# EAGLE design Due Shield v1.0 (EAGLE 7.2.0)
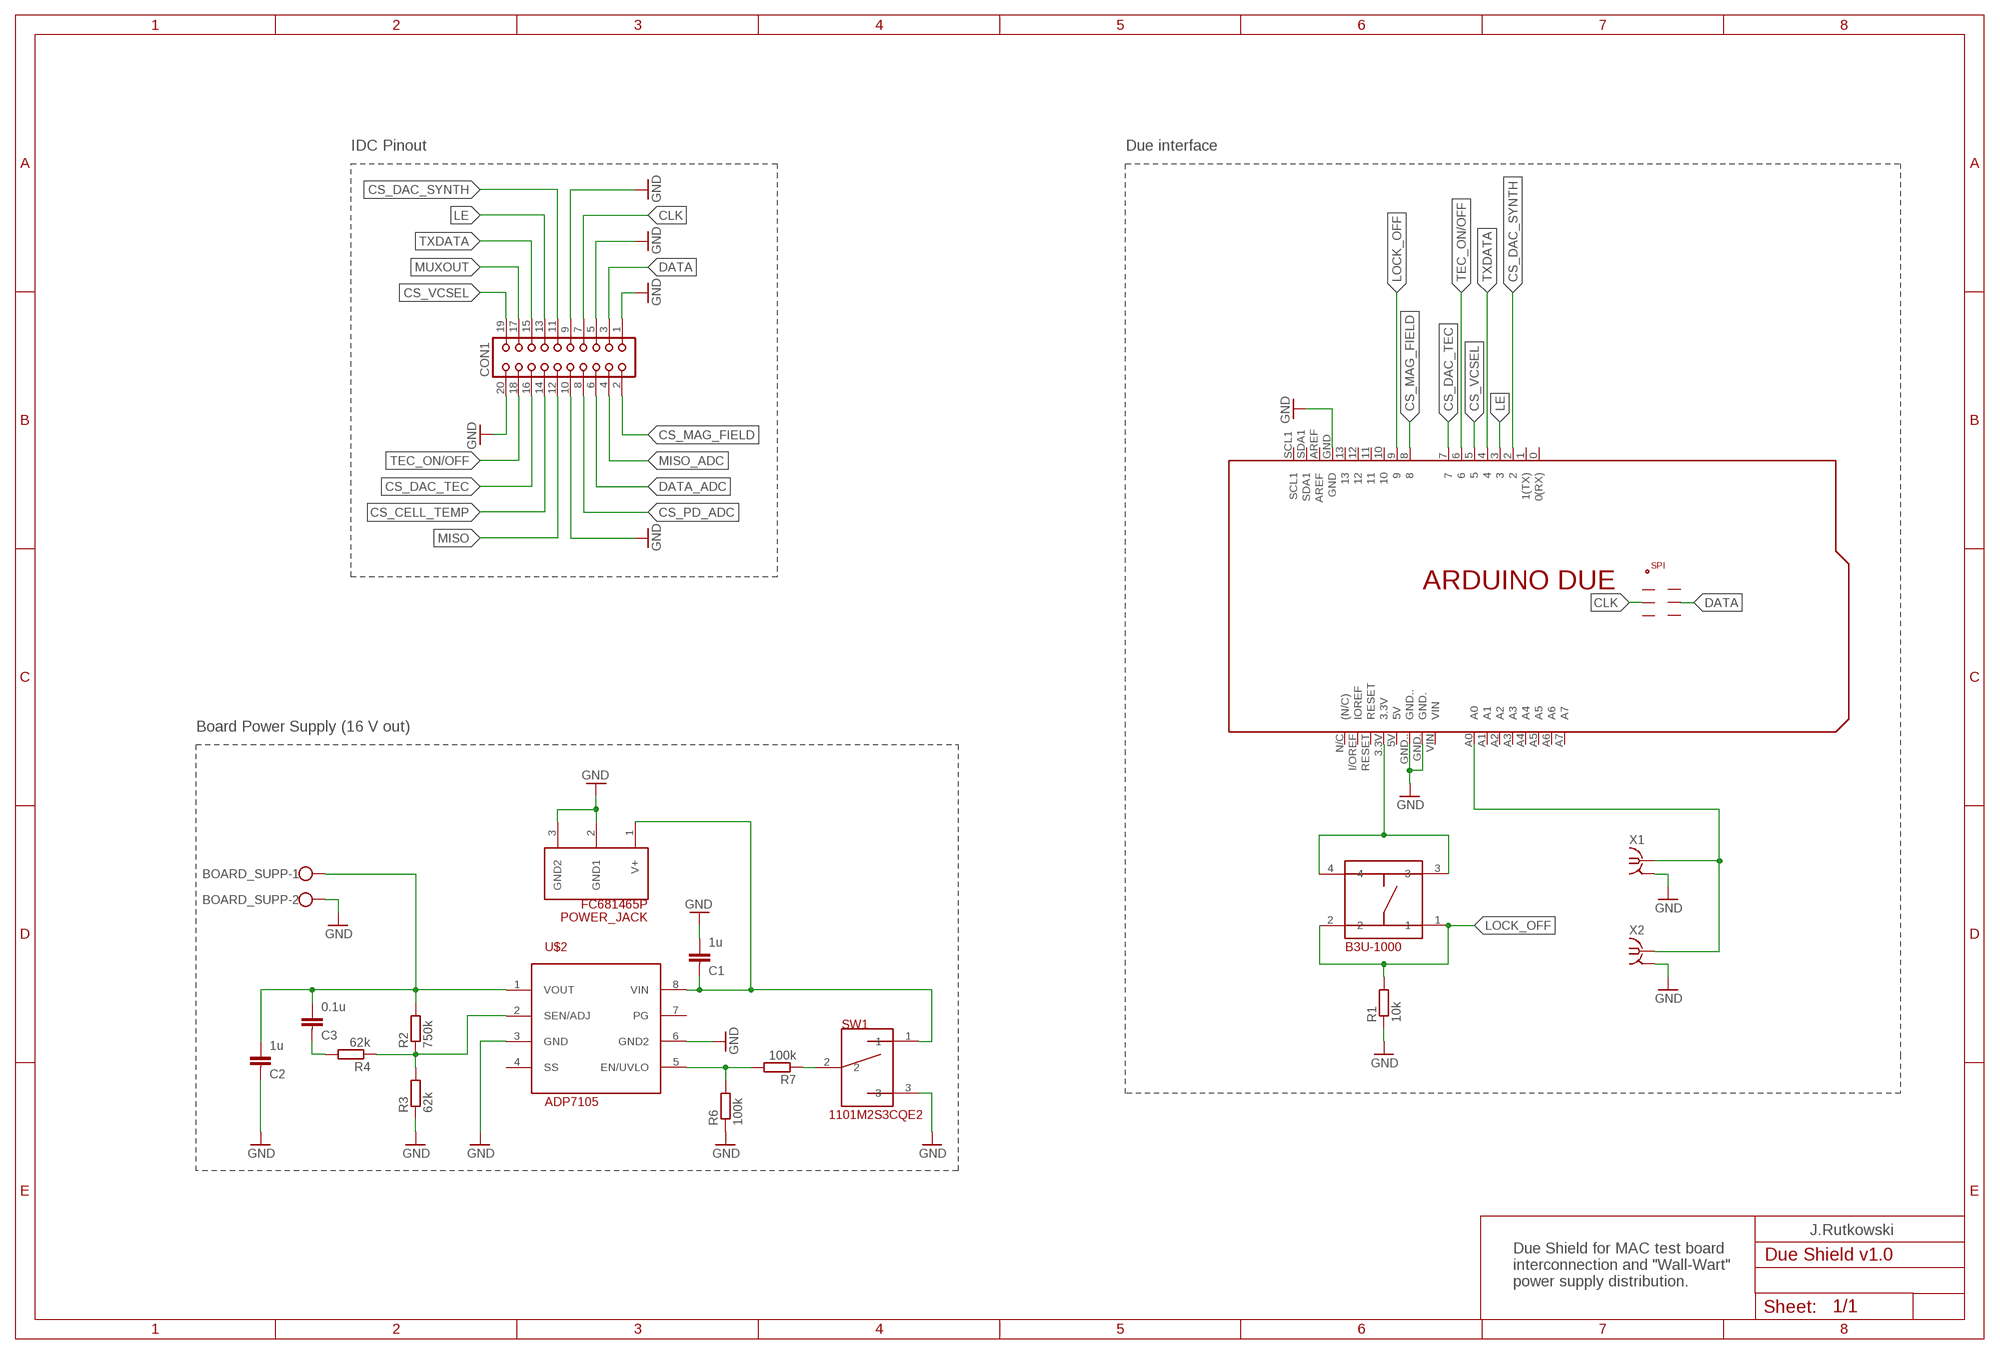
[diagram p0: schematic, sheet 1]

## Parts
BOARD_SUPP  W237-102  [W237-102]
C1  1u  C-EUC0805K  [C0805K]
C2  1u  C-EUC0805K  [C0805K]
C3  0.1u  C-EUC0805K  [C0805K]
CON1  CON20  [CON20]
PCB1  ARDUINO_DUE  [ARDUINO_DUE]
POWER_JACK  FC681465P  [FC681465P]
R1  10k  R-EU_R0603  [R0603]
R2  750k  R-EU_R0603  [R0603]
R3  62k  R-EU_R0603  [R0603]
R4  62k  R-EU_R0603  [R0603]
R6  100k  R-EU_R0603  [R0603]
R7  100k  R-EU_R0603  [R0603]
SW1  1101M2S3CQE2  [1101M2S3CQE2]
U$1  B3U-1000  [B3U-1000]
U$2  ADP7105  [SO8]
X1  BU-SMA-V  [BU-SMA-V]
X2  BU-SMA-V  [BU-SMA-V]

## Nets
CLK: CON1.7 PCB1.SCK
CS_CELL_TEMP: CON1.14
CS_DAC_SYNTH: CON1.11 PCB1.2
CS_DAC_TEC: CON1.16 PCB1.7
CS_MAG_FIELD: CON1.2 PCB1.8
CS_PD_ADC: CON1.8
CS_VCSEL: CON1.19 PCB1.5
DATA: CON1.3 PCB1.MOSI
DATA_ADC: CON1.6
GND: BOARD_SUPP.2 C1.1 C2.2 CON1.1 CON1.5 CON1.9 CON1.10 CON1.20 PCB1.GND PCB1.GND. PCB1.GND.. POWER_JACK.2(GND1) POWER_JACK.3(GND2) R1.1 R3.1 R6.1 SW1.3 U$2.3(GND) U$2.6(GND2) X1.2 X1.3 X1.4 X1.5 X2.2 X2.3 X2.4 X2.5
LE: CON1.13 PCB1.3
LOCK_OFF: PCB1.9 R1.2 U$1.1 U$1.2
MISO: CON1.12
MISO_ADC: CON1.4
MUXOUT: CON1.17
N$1: PCB1.3.3V U$1.3 U$1.4
N$2: PCB1.A0 X1.1 X2.1
N$3: BOARD_SUPP.1 C2.1 C3.1 R2.2 U$2.1(VOUT)
N$4: R2.1 R3.2 R4.1 U$2.2(SEN/ADJ)
N$5: C1.2 POWER_JACK.1(V+) SW1.1 U$2.8(VIN)
N$6: C3.2 R4.2
N$9: R6.2 R7.2 U$2.5(EN/UVLO)
N$10: R7.1 SW1.2
TEC_ON/OFF: CON1.18 PCB1.6
TXDATA: CON1.15 PCB1.4
Unconnected: PCB1.0(0(RX)) PCB1.1(1(TX)) PCB1.5V PCB1.10 PCB1.11 PCB1.12 PCB1.13 PCB1.+5V_ PCB1.A1 PCB1.A2 PCB1.A3 PCB1.A4 PCB1.A5 PCB1.A6 PCB1.A7 PCB1.AREF PCB1.GND__ PCB1.I/OREF(IOREF) PCB1.MISO PCB1.N/C((N/C)) PCB1.RESET PCB1.RESET. PCB1.SCL1 PCB1.SDA1 PCB1.VIN U$2.4(SS) U$2.7(PG)

## Notes on the sheet
- IDC Pinout | Due interface
- Board Power Supply (16 V out)
- J.Rutkowski
- Due Shield for MAC test board
  interconnection and "Wall-Wart" 
  power supply distribution.

## Library data of the parts
BOARD_SUPP = con-wago-500:W237-102: WAGO SCREW CLAMP; MPN: 237-102; OC_FARNELL: unknown; OC_NEWARK: 70K9898
C1-C3 = rcl:C-EU: CAPACITOR, European symbol
CON1 = con-harting:CON20: CONNECTOR; OC_FARNELL: unknown; OC_NEWARK: unknown
PCB1 = E14_Arduino_revB:ARDUINO_DUE: Device for representing an Arduino Due board with a footprint in an EAGLE design. Created by Dave Young for Element14. More EAGLE documentation at: http://www.element14.com/community/community/knode/cadsoft_eagle
POWER_JACK = Custom-parts:FC681465P
R1-R4 R6 R7 = rcl:R-EU_: RESISTOR, European symbol
SW1 = Custom-parts:1101M2S3CQE2: Miniature SPDT Slide Switch; OC_FARNELL: 1437697
U$1 = Custom-parts:B3U-1000
U$2 = analog-devices:ADP7105
X1 X2 = con-coax:BU-SMA-V: FEMALE SMA CONNECTOR Radiall distributor RS 112-3794; OC_FARNELL: unknown; OC_NEWARK: unknown

## Board
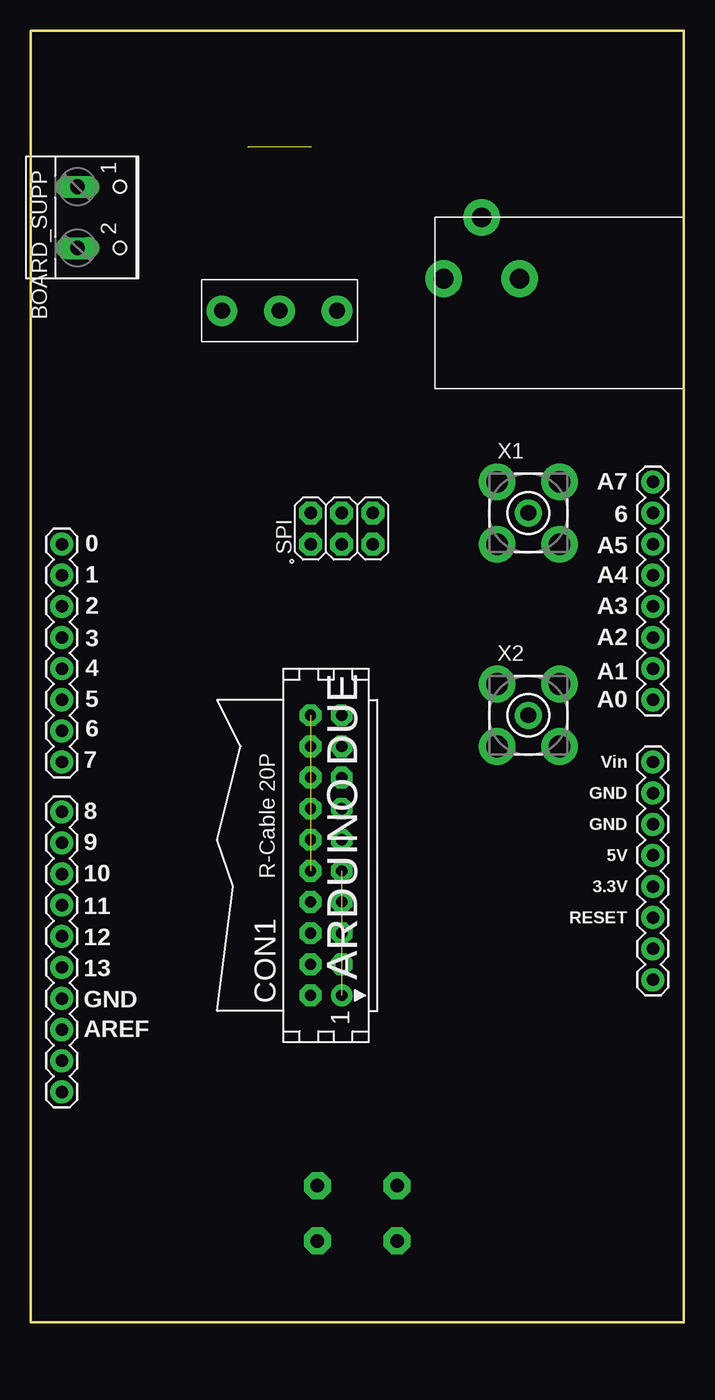
[diagram p1: board, top side]
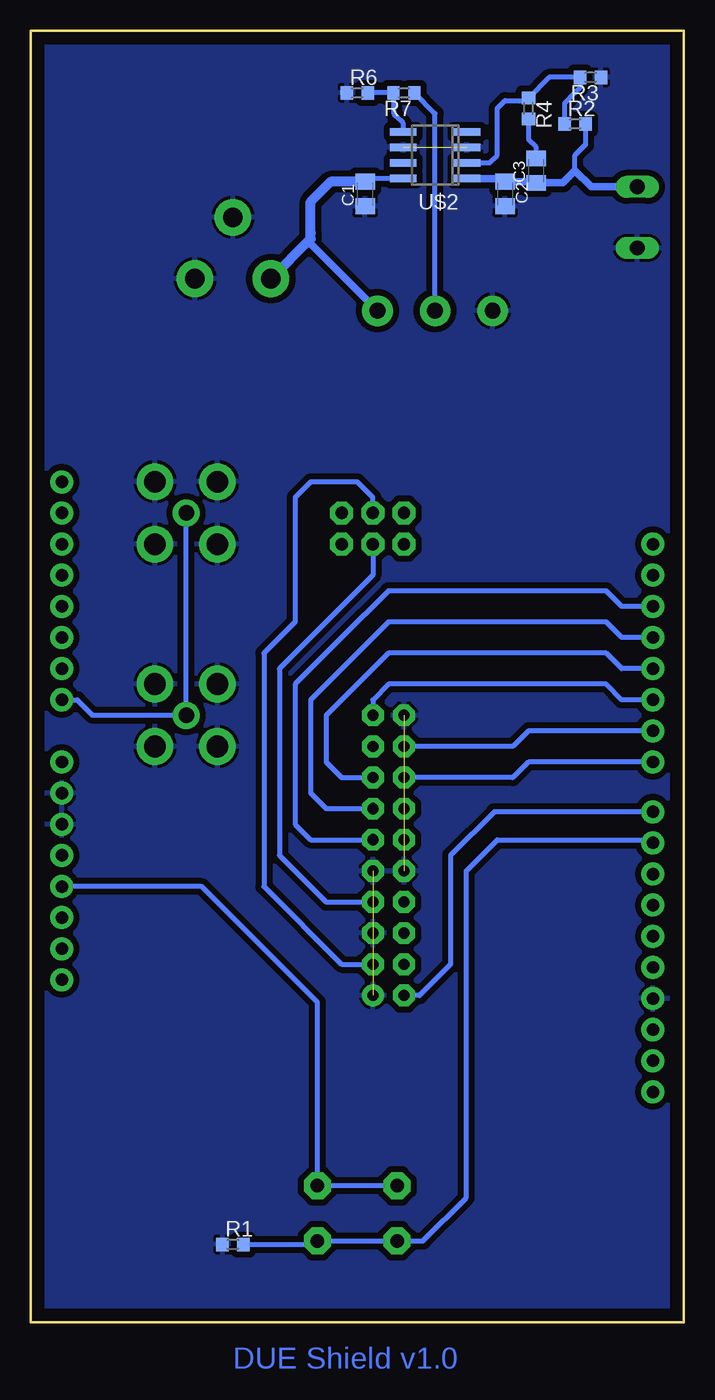
[diagram p2: board, bottom side, seen from below]

Size 53.34 x 105.41 mm. Coordinates in mm from the lower left corner, seen from the top.
Copper layers (1*16): Top 0.035mm / dielectric 1.5mm / Bottom 0.035mm
Design rules "default": minimum track width 10mil, minimum drill 24mil, track to track 8mil, track to pad 8mil, pad to pad 8mil, via to via 8mil, smd to smd 8mil, copper to edge 40mil, drill to drill 8mil, minimum pad ring 10mil, minimum via ring 8mil, stop-mask expansion 4mil, vias tented up to drill 0mil, thermal gap 10mil

### Footprints (pad centres in the part's own frame; a part is rotated, then mirrored left to right if it is on the bottom)
W237-102 = drill 1.194 long: 1 -2.5,-1.27; 2 2.5,-1.27
C0805K = smd 1.3 x 1.6: 1 -1,0; 2 1,0
CON20 = drill 0.914 pad 1.778: 1 -11.43,-1.27 | drill 0.914 pad 1.778 octagon: 2 -11.43,1.27; 3 -8.89,-1.27; 4 -8.89,1.27; 5 -6.35,-1.27; 6 -6.35,1.27; 7 -3.81,-1.27; 8 -3.81,1.27; 9 -1.27,-1.27; 10 -1.27,1.27; 11 1.27,-1.27; 12 1.27,1.27; 13 3.81,-1.27; 14 3.81,1.27; 15 6.35,-1.27; 16 6.35,1.27; 17 8.89,-1.27; 18 8.89,1.27; 19 11.43,-1.27; 20 11.43,1.27
ARDUINO_DUE = drill 1.016 pad 1.88: 0 63.5,50.8; 1 60.96,50.8; 2 58.42,50.8; 3 55.88,50.8; 3.3V 35.56,2.54; 4 53.34,50.8; 5 50.8,50.8; 5V 38.1,2.54; 6 48.26,50.8; 7 45.72,50.8; 8 41.656,50.8; 9 39.116,50.8; 10 36.576,50.8; 11 34.036,50.8; 12 31.496,50.8; 13 28.956,50.8; A0 50.8,2.54; A1 53.34,2.54; A2 55.88,2.54; A3 58.42,2.54; A4 60.96,2.54; A5 63.5,2.54; A6 66.04,2.54; A7 68.58,2.54; AREF 23.876,50.8; GND 26.416,50.8; GND. 43.18,2.54; GND.. 40.64,2.54; I/OREF 30.48,2.54; N/C 27.94,2.54; RESET 33.02,2.54; SCL1 18.796,50.8; SDA1 21.336,50.8; VIN 45.72,2.54 | drill 1.016 pad 1.88 octagon: +5V_ 66.04,30.48; GND__ 66.04,25.4; MISO 63.5,30.48; MOSI 66.04,27.94; RESET. 63.5,25.4; SCK 63.5,27.94
FC681465P = drill 1.6 pad 3: 1 3.1,5; 2 0,0; 3 -3.1,5
R0603 = smd 1 x 1.1: 1 -0.85,0; 2 0.85,0
1101M2S3CQE2 = drill 1.3 pad 2.5: 1 0,-4.7; 2 0,0; 3 0,4.7
B3U-1000 = drill 1.1 pad 2.184 octagon: 1 3.25,-2.25; 2 -3.25,-2.25; 3 3.25,2.25; 4 -3.25,2.25
SO8 = smd 0.6 x 2.2: 1 -1.905,-2.6; 2 -0.635,-2.6; 3 0.635,-2.6; 4 1.905,-2.6; 5 1.905,2.6; 6 0.635,2.6; 7 -0.635,2.6; 8 -1.905,2.6
BU-SMA-V = drill 1.27 pad 2.2: 1 0,0 | drill 1.778 pad 3: 2 -2.55,2.55; 3 2.55,2.55; 4 2.55,-2.55; 5 -2.55,-2.55

### Placement (x,y rotation side)
BOARD_SUPP  5.08,90.17 270 top
C1  26.04,92.08 90 bottom
C2  14.61,92.08 270 bottom
C3  12.06,93.98 90 bottom
CON1  24.13,38.1 90 top
PCB1  53.34,0 90 top
POWER_JACK  36.83,90.17 180 top
R1  36.83,6.35 0 bottom
R2  8.89,97.79 0 bottom
R3  7.62,101.6 180 bottom
R4  12.7,99.06 270 bottom
R6  26.67,100.33 0 bottom
R7  22.86,100.33 180 bottom
SW1  20.32,82.55 90 top
U$1  26.67,8.89 0 top
U$2  20.32,95.25 90 bottom
X1  40.64,66.04 0 top
X2  40.64,49.53 0 top

### Tracks (layer width: path | path; a pad name or v marks a point on that pad's centre or on a via)
CLK
  Bottom 0.406: PCB1.SCK 25.4,60.96 27.94,58.42 29.21,57.15 33.02,53.34 33.02,38.1 29.21,34.29 CON1.7
CS_DAC_SYNTH
  Bottom 0.406: PCB1.2 5.08,58.42 6.35,59.69 24.13,59.69 | 24.13,59.69 27.94,55.88 | 27.94,55.88 24.13,59.69 | 24.13,59.69 27.94,55.88 | 27.94,55.88 31.75,52.07 31.75,40.64 30.48,39.37 CON1.11
CS_DAC_TEC
  Bottom 0.406: PCB1.7 12.7,45.72 13.97,44.45 CON1.16
CS_MAG_FIELD
  Bottom 0.406: PCB1.8 15.49,41.66 19.05,38.1 19.05,29.21 21.59,26.67 CON1.2
CS_VCSEL
  Bottom 0.406: PCB1.5 5.08,50.8 6.35,52.07 24.13,52.07 25.4,50.8 CON1.19
DATA
  Bottom 0.406: PCB1.MOSI 25.4,67.31 26.67,68.58 30.48,68.58 31.75,67.31 31.75,57.15 34.29,54.61 34.29,35.56 27.94,29.21 CON1.3
GND  (4 unrouted)
  pour Bottom (isolate 0.5): 0,105.41 0,0 53.34,0 53.34,105.41
LE
  Bottom 0.406: PCB1.3 5.08,55.88 6.35,57.15 24.13,57.15 30.48,50.8 30.48,43.18 29.21,41.91 CON1.13
LOCK_OFF
  Bottom 0.406: R1.2 30.21,6.35 U$1.1 U$1.2 21.3,6.64 17.78,10.16 17.78,36.83 15.24,39.37 2.79,39.37 PCB1.9
N$1
  Bottom 0.406: U$1.4 U$1.3 29.92,26.11 39.37,35.56 PCB1.3.3V
N$2
  Bottom 0.406: PCB1.A0 49.53,50.8 48.26,49.53 X2.1 X1.1
N$3
  Bottom 0.406: 14.88,93.34 C2.1 | 12.16,93.08 C3.1 | 8.89,93.98 8.89,95.25 8.04,96.1 R2.2
  Bottom 0.61: U$2.1 14.88,93.34 | C2.1 12.16,93.08 | C3.1 9.89,92.98 8.89,93.98 7.58,92.67 BOARD_SUPP.1
N$4
  Bottom 0.406: U$2.2 15.88,94.61 15.24,95.25 15.24,99.06 14.61,99.69 12.91,99.69 R4.1 11.01,101.6 R3.2 8.47,100.75 8.89,100.33 9.74,99.48 R2.1
N$5
  Bottom 0.406: U$2.8 25.77,93.34 C1.2
  Bottom 0.61: SW1.1 30.48,88.01 30.48,88.9
  Bottom 0.813: C1.2 28.84,93.08 30.48,91.44 30.48,88.9 30.48,88.42 POWER_JACK.1
N$6
  Bottom 0.406: R4.2 12.7,96.52 12.06,95.89 C3.2
N$9
  Bottom 0.406: R6.2 R7.2 23.71,98.64 23.5,98.42 22.92,97.85 U$2.5
N$10
  Bottom 0.406: SW1.2 20.32,98.64 R7.1
TEC_ON/OFF
  Bottom 0.406: PCB1.6 12.7,48.26 13.97,46.99 CON1.18
TXDATA
  Bottom 0.406: PCB1.4 5.08,53.34 6.35,54.61 24.13,54.61 29.21,49.53 29.21,45.72 27.94,44.45 CON1.15

### Text on the board
Bottom: DUE Shield v1.0
Top_Legend: +16 V | Board supply / 16 V DC | Supply 18 ~ 20 V | GND | OFF ON | PD Signal | Board I/O IDC | FEMTO - ST 2016 / MAC adapter shield v1.0 / DUE compatible | Lock OFF
Bottom_legend: R3 | R4 | R7 | R6 | U$2 | R2 | C3 | C2 | C1